# EAGLE design Peri (EAGLE 4.16)
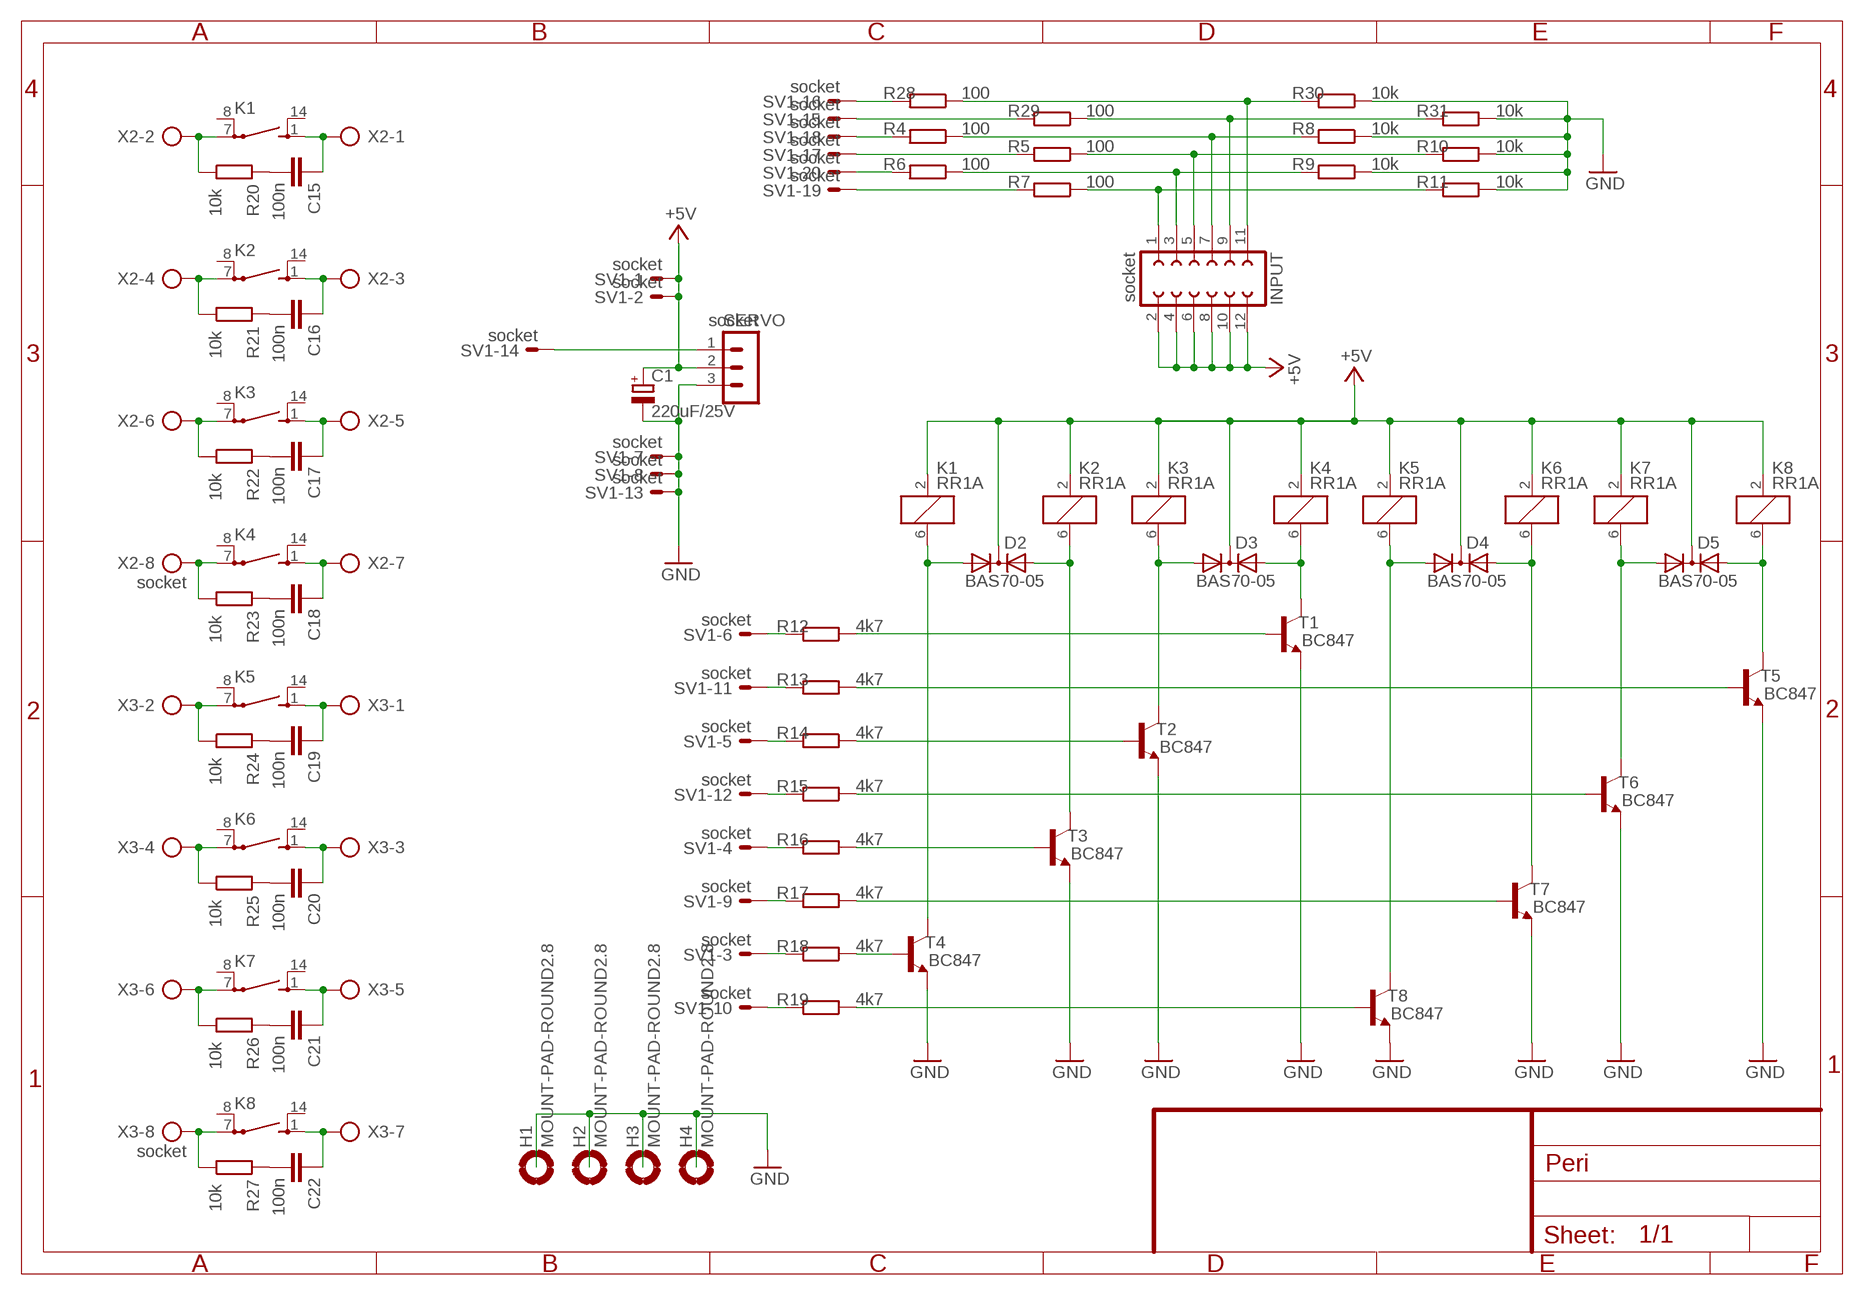
[diagram p0: schematic, sheet 1]

## Parts
C1  220uF/25V  CPOL-EUE3.5-8  [E3,5-8]
C15  100n  C-EUC0603K  [C0603K]
C16  100n  C-EUC0603K  [C0603K]
C17  100n  C-EUC0603K  [C0603K]
C18  100n  C-EUC0603K  [C0603K]
C19  100n  C-EUC0603K  [C0603K]
C20  100n  C-EUC0603K  [C0603K]
C21  100n  C-EUC0603K  [C0603K]
C22  100n  C-EUC0603K  [C0603K]
D2  BAS70-05  [SOT23]
D3  BAS70-05  [SOT23]
D4  BAS70-05  [SOT23]
D5  BAS70-05  [SOT23]
H1  MOUNT-PAD-ROUND2.8  [2,8-PAD]
H2  MOUNT-PAD-ROUND2.8  [2,8-PAD]
H3  MOUNT-PAD-ROUND2.8  [2,8-PAD]
H4  MOUNT-PAD-ROUND2.8  [2,8-PAD]
INPUT  socket  FE06-2  [FE06-2]
K1  RR1A  [RR1A]
K2  RR1A  [RR1A]
K3  RR1A  [RR1A]
K4  RR1A  [RR1A]
K5  RR1A  [RR1A]
K6  RR1A  [RR1A]
K7  RR1A  [RR1A]
K8  RR1A  [RR1A]
R4  100  R-EU_R0805  [R0805]
R5  100  R-EU_R0805  [R0805]
R6  100  R-EU_R0805  [R0805]
R7  100  R-EU_R0805  [R0805]
R8  10k  R-EU_R0805  [R0805]
R9  10k  R-EU_R0805  [R0805]
R10  10k  R-EU_R0805  [R0805]
R11  10k  R-EU_R0805  [R0805]
R12  4k7  R-EU_R0805  [R0805]
R13  4k7  R-EU_R0805  [R0805]
R14  4k7  R-EU_R0805  [R0805]
R15  4k7  R-EU_R0805  [R0805]
R16  4k7  R-EU_R0805  [R0805]
R17  4k7  R-EU_R0805  [R0805]
R18  4k7  R-EU_R0805  [R0805]
R19  4k7  R-EU_R0805  [R0805]
R20  10k  R-EU_R0805  [R0805]
R21  10k  R-EU_R0805  [R0805]
R22  10k  R-EU_R0805  [R0805]
R23  10k  R-EU_R0805  [R0805]
R24  10k  R-EU_R0805  [R0805]
R25  10k  R-EU_R0805  [R0805]
R26  10k  R-EU_R0805  [R0805]
R27  10k  R-EU_R0805  [R0805]
R28  100  R-EU_R0805  [R0805]
R29  100  R-EU_R0805  [R0805]
R30  10k  R-EU_R0805  [R0805]
R31  10k  R-EU_R0805  [R0805]
SERVO  socket  MA03-1  [MA03-1]
SV1  socket  ML20E  [ML20]
T1  BC847  [SOT23]
T2  BC847  [SOT23]
T3  BC847  [SOT23]
T4  BC847  [SOT23]
T5  BC847  [SOT23]
T6  BC847  [SOT23]
T7  BC847  [SOT23]
T8  BC847  [SOT23]
X2  socket  AK500/8  [AK500/8]
X3  socket  AK500/8  [AK500/8]

## Nets
+5V: C1.+ D2.3(C) D3.3(C) D4.3(C) D5.3(C) INPUT.2 INPUT.4 INPUT.6 INPUT.8 INPUT.10 INPUT.12 K1.2 K2.2 K3.2 K4.2 K5.2 K6.2 K7.2 K8.2 SERVO.2 SV1.1 SV1.2
GND: C1.- H1.B2,8(MOUNT) H2.B2,8(MOUNT) H3.B2,8(MOUNT) H4.B2,8(MOUNT) R8.1 R9.1 R10.1 R11.1 R30.1 R31.1 SERVO.3 SV1.7 SV1.8 SV1.13 T1.2(E) T2.2(E) T3.2(E) T4.2(E) T5.2(E) T6.2(E) T7.2(E) T8.2(E)
N$1: R14.2 SV1.5
N$2: R19.2 SV1.10
N$3: R15.2 SV1.12
N$4: R6.2 SV1.20
N$5: R7.2 SV1.19
N$6: R28.2 SV1.16
N$7: R29.2 SV1.15
N$8: R4.2 SV1.18
N$9: R5.2 SV1.17
N$10: R16.2 SV1.4
N$11: SERVO.1 SV1.14
N$12: R18.2 SV1.3
N$20: D2.1(A1) K1.6 T4.3(C)
N$21: D2.2(A2) K2.6 T3.3(C)
N$22: D3.1(A1) K3.6 T2.3(C)
N$23: D3.2(A2) K4.6 T1.3(C)
N$24: INPUT.7 R4.1 R8.2
N$25: INPUT.5 R5.1 R10.2
N$26: INPUT.3 R6.1 R9.2
N$27: INPUT.1 R7.1 R11.2
N$28: R13.1 T5.1(B)
N$29: R14.1 T2.1(B)
N$30: R15.1 T6.1(B)
N$31: R12.1 T1.1(B)
N$32: D4.1(A1) K5.6 T8.3(C)
N$33: D4.2(A2) K6.6 T7.3(C)
N$34: D5.1(A1) K7.6 T6.3(C)
N$35: D5.2(A2) K8.6 T5.3(C)
N$36: R16.1 T3.1(B)
N$37: R17.1 T7.1(B)
N$38: R18.1 T4.1(B)
N$39: R19.1 T8.1(B)
N$42: R17.2 SV1.9
N$46: R13.2 SV1.11
N$47: R12.2 SV1.6
N$48: C15.2 R20.2
N$49: C15.1 K1.1(2:S) X2.1
N$50: K1.7(2:P) R20.1 X2.2
N$51: C16.2 R21.2
N$52: C16.1 K2.1(2:S) X2.3
N$53: K2.7(2:P) R21.1 X2.4
N$54: C17.2 R22.2
N$55: C17.1 K3.1(2:S) X2.5
N$56: K3.7(2:P) R22.1 X2.6
N$57: C18.2 R23.2
N$58: C18.1 K4.1(2:S) X2.7
N$59: K4.7(2:P) R23.1 X2.8
N$60: C19.2 R24.2
N$61: C19.1 K5.1(2:S) X3.1
N$62: K5.7(2:P) R24.1 X3.2
N$63: C20.2 R25.2
N$64: C20.1 K6.1(2:S) X3.3
N$65: K6.7(2:P) R25.1 X3.4
N$66: C21.2 R26.2
N$67: C21.1 K7.1(2:S) X3.5
N$68: K7.7(2:P) R26.1 X3.6
N$69: C22.2 R27.2
N$70: C22.1 K8.1(2:S) X3.7
N$71: K8.7(2:P) R27.1 X3.8
N$74: INPUT.11 R28.1 R30.2
N$75: INPUT.9 R29.1 R31.2
Unconnected: K1.8(2:P) K1.14(2:S) K2.8(2:P) K2.14(2:S) K3.8(2:P) K3.14(2:S) K4.8(2:P) K4.14(2:S) K5.8(2:P) K5.14(2:S) K6.8(2:P) K6.14(2:S) K7.8(2:P) K7.14(2:S) K8.8(2:P) K8.14(2:S)

## Library data of the parts
C1 = rcl:CPOL-EU: POLARIZED CAPACITOR, European symbol
C15-C22 = rcl:C-EU: CAPACITOR, European symbol
D2-D5 = diode:BAS70-05: Silicon Schottky Diodes General-purpose diode for high-speed switching
H1-H4 = holes:MOUNT-PAD-ROUND: MOUNTING PAD, round
INPUT = con-lsta:FE06-2: FEMALE HEADER
K1-K8 = relay:RR1A: RELAY reed, polarity, 1 x norm. open with shield
R4-R31 = rcl:R-EU_: RESISTOR, European symbol
SERVO = con-lstb:MA03-1: PIN HEADER
SV1 = con-harting-ml:ML20?E: HARTING
T1-T8 = transistor:BC847: NPN TRANSISTOR
X2 X3 = con-ptr500:AK500/8: CONNECTOR

## Board
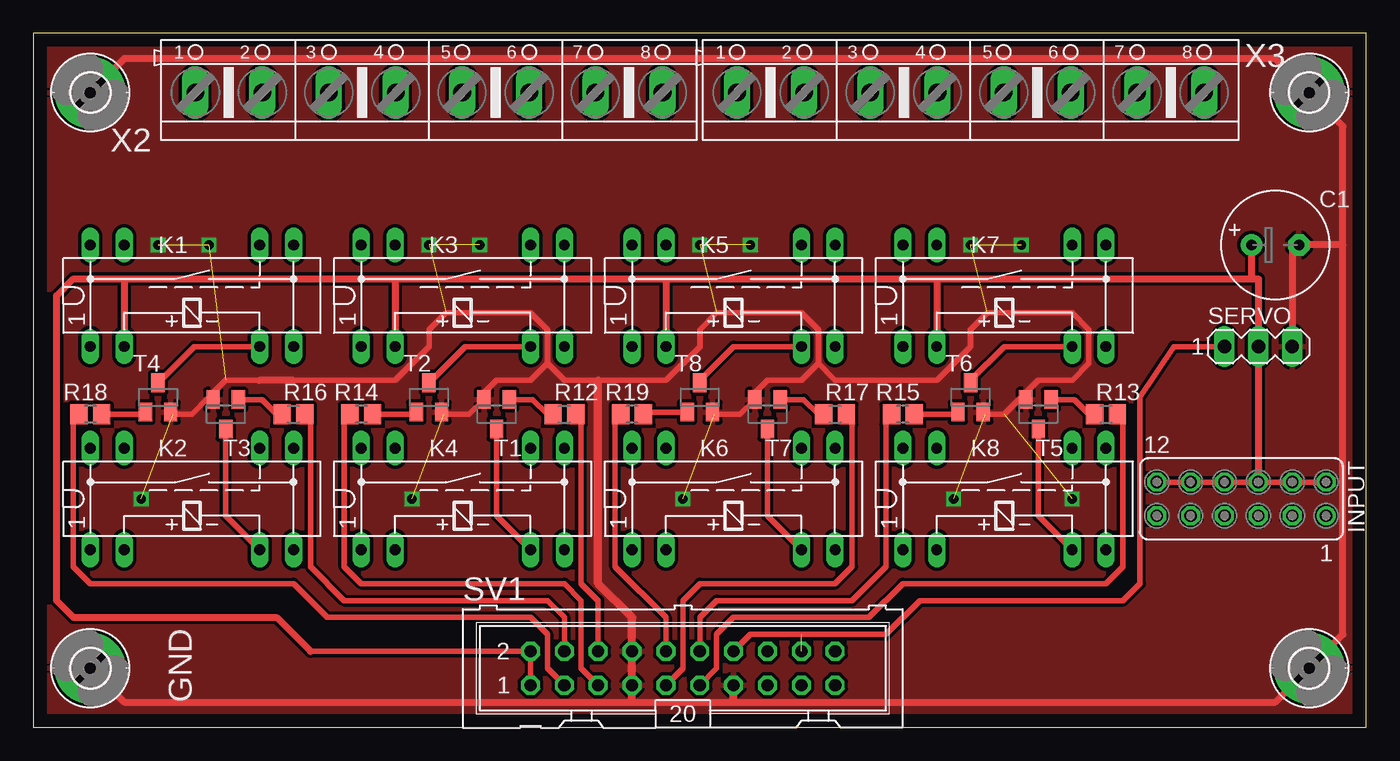
[diagram p1: board, top side]
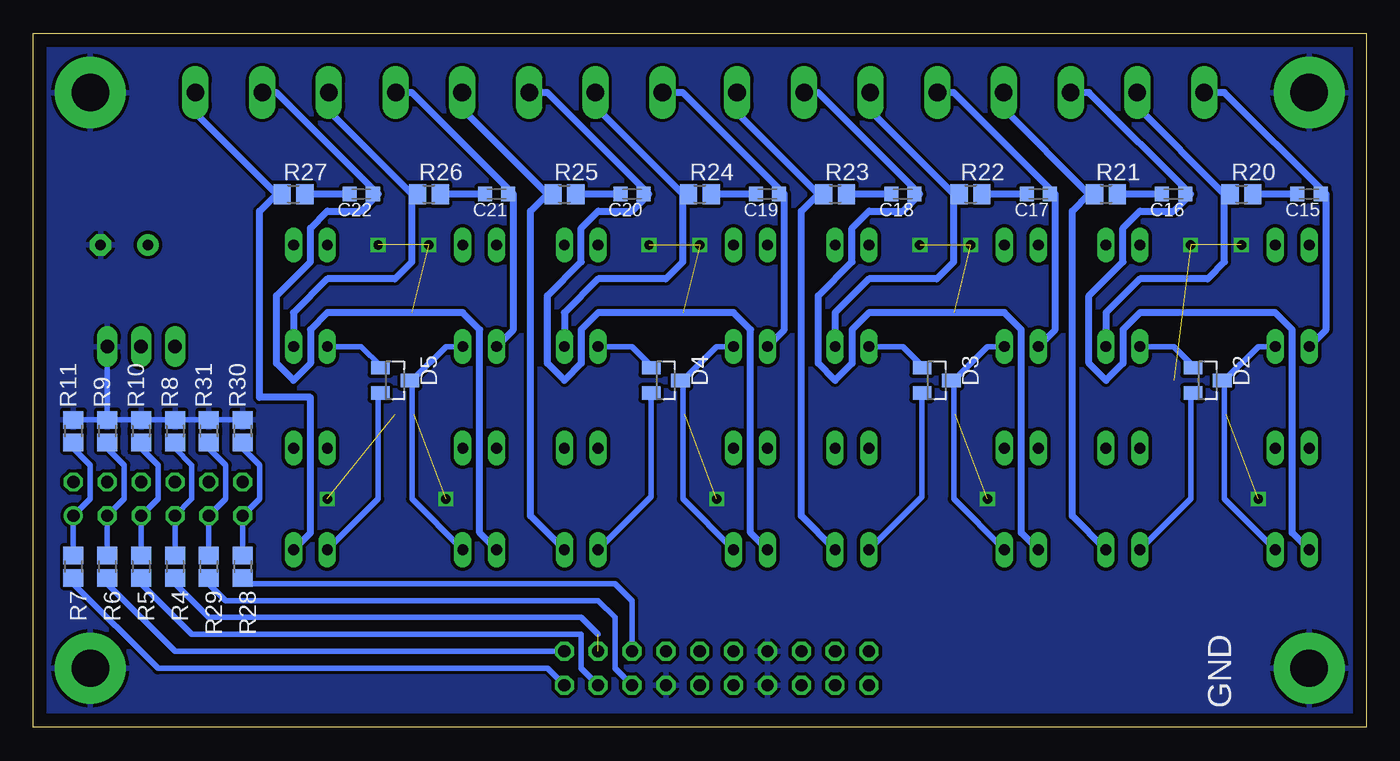
[diagram p2: board, bottom side, seen from below]

Size 100 x 52.05 mm. Coordinates in mm from the lower left corner, seen from the top.
Outline: 0,52.05 0,0 100,0 100,52.05 0,52.05
Copper layers (1*16): Top 0.035mm / dielectric 1.5mm / Bottom 0.035mm
Design rules "olimex_10mils": minimum track width 10mil, minimum drill 24mil, track to track 10mil, track to pad 10mil, pad to pad 10mil, via to via 10mil, smd to smd 10mil, copper to edge 40mil, drill to drill 10mil, minimum pad ring 10mil, minimum via ring 8mil, stop-mask expansion 0mil, vias tented up to drill 0mil, thermal gap 10mil

### Footprints (pad centres in the part's own frame; a part is rotated, then mirrored left to right if it is on the bottom)
E3,5-8 = drill 0.813 pad 1.6 round: + -1.778,0 | drill 0.813 pad 1.6 octagon: - 1.778,0
C0603K = smd 1.05 x 1.08: 1 -0.875,0; 2 0.875,0
SOT23 = smd 1 x 1.4: 1 -0.95,-1.1; 2 0.95,-1.1; 3 0,1.1
2,8-PAD = drill 2.8 pad 5.334 round: B2,8 0,0
FE06-2 = drill 0.914 round: 1 -6.35,1.27 | drill 0.914 octagon: 2 -6.35,-1.27; 3 -3.81,1.27; 4 -3.81,-1.27; 5 -1.27,1.27; 6 -1.27,-1.27; 7 1.27,1.27; 8 1.27,-1.27; 9 3.81,1.27; 10 3.81,-1.27; 11 6.35,1.27; 12 6.35,-1.27
RR1A = drill 0.813 long: 1 -7.62,-3.81; 2 -5.08,-3.81; 6 5.08,-3.81; 7 7.62,-3.81; 8 7.62,3.81; 9 5.08,3.81; 13 -5.08,3.81; 14 -7.62,3.81
R0805 = smd 1.3 x 1.5: 1 -0.85,0; 2 0.85,0
MA03-1 = drill 1.016 long: 1 -2.54,0; 2 0,0; 3 2.54,0
ML20 = drill 0.914 octagon: 1 -11.43,-1.27; 2 -11.43,1.27; 3 -8.89,-1.27; 4 -8.89,1.27; 5 -6.35,-1.27; 6 -6.35,1.27; 7 -3.81,-1.27; 8 -3.81,1.27; 9 -1.27,-1.27; 10 -1.27,1.27; 11 1.27,-1.27; 12 1.27,1.27; 13 3.81,-1.27; 14 3.81,1.27; 15 6.35,-1.27; 16 6.35,1.27; 17 8.89,-1.27; 18 8.89,1.27; 19 11.43,-1.27; 20 11.43,1.27
AK500/8 = drill 1.321 long: 1 -17.526,0; 2 -12.497,0; 3 -7.518,0; 4 -2.489,0; 5 2.489,0; 6 7.518,0; 7 12.497,0; 8 17.526,0

### Placement (x,y rotation side)
C1  93.18,36.18 0 top
C15  4.28,39.99 180 bottom
C16  14.44,39.99 180 bottom
C17  24.6,39.99 180 bottom
C18  34.76,39.99 180 bottom
C19  44.92,39.99 180 bottom
C20  55.08,39.99 180 bottom
C21  65.24,39.99 180 bottom
C22  75.4,39.99 180 bottom
D2  11.9,26.02 270 bottom
D3  32.22,26.02 270 bottom
D4  52.54,26.02 270 bottom
D5  72.86,26.02 270 bottom
H1  95.72,47.61 270 top
H2  4.28,47.61 270 top
H3  4.28,4.43 270 top
H4  95.72,4.43 270 top
INPUT  90.64,17.13 180 top
K1  11.9,32.37 0 top
K2  11.9,17.13 0 top
K3  32.22,32.37 0 top
K4  32.22,17.13 0 top
K5  52.54,32.37 0 top
K6  52.54,17.13 0 top
K7  72.86,32.37 0 top
K8  72.86,17.13 0 top
R4  89.37,12.05 270 bottom
R5  91.91,12.05 270 bottom
R6  94.45,12.05 270 bottom
R7  96.99,12.05 270 bottom
R8  89.37,22.21 270 bottom
R9  94.45,22.21 270 bottom
R10  91.91,22.21 270 bottom
R11  96.99,22.21 270 bottom
R12  39.84,23.48 0 top
R13  80.48,23.48 0 top
R14  24.6,23.48 180 top
R15  65.24,23.48 180 top
R16  19.52,23.48 0 top
R17  60.16,23.48 0 top
R18  4.28,23.48 180 top
R19  44.92,23.48 180 top
R20  9.36,39.99 0 bottom
R21  19.52,39.99 0 bottom
R22  29.68,39.99 0 bottom
R23  39.84,39.99 0 bottom
R24  50,39.99 0 bottom
R25  60.16,39.99 0 bottom
R26  70.32,39.99 0 bottom
R27  80.48,39.99 0 bottom
R28  84.29,12.05 270 bottom
R29  86.83,12.05 270 bottom
R30  84.29,22.21 270 bottom
R31  86.83,22.21 270 bottom
SERVO  91.91,28.56 0 top
SV1  48.73,4.43 0 top
T1  34.76,23.48 180 top
T2  29.68,24.75 0 top
T3  14.44,23.48 180 top
T4  9.36,24.75 0 top
T5  75.4,23.48 180 top
T6  70.32,24.75 0 top
T7  55.08,23.48 180 top
T8  50,24.75 0 top
X2  29.68,47.61 0 top
X3  70.32,47.61 0 top

### Tracks (layer width: path | path; a pad name or v marks a point on that pad's centre or on a via)
+5V
  Top 0.406: INPUT.2 INPUT.4 INPUT.6 INPUT.8 INPUT.10 INPUT.12 | 20.79,5.7 SV1.2 SV1.1
  Top 0.51: 91.4,33.64 C1.+ | 20.79,5.7 18.25,8.24 3.01,8.24 1.74,9.51 1.74,32.37 3.01,33.64 6.82,33.64 | 91.4,33.64 91.91,33.64 SERVO.2 INPUT.6 | 6.82,33.64 27.14,33.64 | 27.14,33.64 47.46,33.64 | 47.46,33.64 67.78,33.64 | 67.78,33.64 91.4,33.64 | 67.78,33.64 K7.2 | 47.46,33.64 K5.2 | 27.14,33.64 K3.2 | 6.82,33.64 K1.2
  Bottom 0.406: 51.27,26.02 D4.3 | K5.2 48.73,28.56 51.27,26.02 | 51.27,26.02 51.27,17.13 K6.2 | K3.2 28.41,28.56 30.95,26.02 | 30.95,26.02 D3.3 | K4.2 30.95,17.13 30.95,26.02 | K1.2 8.09,28.56 10.63,26.02 | 10.63,26.02 D2.3 | K2.2 10.63,17.13 10.63,26.02 | K7.2 69.05,28.56 71.59,26.02 | 71.59,26.02 D5.3 | K8.2 71.59,17.13 71.59,26.02
GND  (via drill 0.7)  (13 unrouted)
  Top 0.406: 13.17,24.75 13.34,24.58 T3.2 | 16.98,26.02 14.44,26.02 13.17,24.75 | T4.2 10.48,23.48 11.9,23.48 13.17,24.75 | T2.2 30.8,23.48 32.71,23.48 T1.2 33.66,24.58 33.49,24.75 34.76,26.02 37.3,26.02 38.57,27.29 | 19.52,26.02 27.14,26.02 29.68,28.56 29.68,29.83 30.95,31.1 37.3,31.1 38.57,29.83 38.57,27.29 | T8.2 51.12,23.48 53.03,23.48 T7.2 53.98,24.58 53.81,24.75 55.08,26.02 57.62,26.02 58.89,27.29 | 38.57,27.29 39.84,26.02 42.38,26.02 47.46,26.02 50,28.56 50,29.83 51.27,31.1 57.62,31.1 58.89,29.83 58.89,27.29 | 58.89,27.29 60.16,26.02 67.78,26.02 70.32,28.56 70.32,29.83 71.59,31.1 77.94,31.1 79.21,29.83 79.21,27.29 77.94,26.02 75.4,26.02 74.13,24.75 | 74.13,24.75 74.3,24.58 T5.2 | T6.2 71.44,23.48 72.86,23.48 74.13,24.75
  Top 0.51: 98.26,36.18 98.26,6.97 H4.B2,8 93.18,1.89 52.54,1.89 44.92,1.89 6.82,1.89 H3.B2,8 | 98.26,36.18 98.26,45.07 H1.B2,8 93.18,50.15 6.82,50.15 H2.B2,8 | 19.52,26.02 16.98,26.02 | 98.26,36.18 95.72,36.18 | 95.72,36.18 C1.- | SERVO.3 94.45,36.18 95.72,36.18
  Top 0.61: 42.38,26.02 42.38,10.78 44.92,8.24 SV1.8 SV1.7 44.92,1.89 | 52.54,1.89 SV1.13
  Bottom 0.406: R11.1 94.87,23.06 94.45,23.48 | R30.1 84.29,23.48 84.71,23.06 R31.1 86.83,23.48 87.25,23.06 R8.1 89.37,23.48 89.79,23.06 R10.1 91.91,23.48 92.33,23.06 R9.1 94.45,23.48 | SERVO.3 94.45,23.48
  other vias: 74.13,36.18 70.32,36.18 53.81,36.18 50,36.18 33.49,36.18 29.68,36.18 13.17,36.18 9.36,36.18 77.94,17.13 69.05,17.13 48.73,17.13 28.41,17.13 8.09,17.13
  pour Top (isolate 0.254): 0.47,51.42 99.53,51.42 99.53,0.62 0.47,0.62
  pour Bottom (isolate 0.254): 0.47,51.42 99.53,51.42 99.53,0.62 0.47,0.62 0.47,50.15
N$1
  Top 0.406: R14.2 23.33,23.48 23.33,12.05 24.6,10.78 39.84,10.78 41.11,9.51 41.11,4.43 SV1.5
N$2
  Top 0.406: R19.2 43.65,23.48 43.65,12.05 47.46,8.24 SV1.10
N$3
  Top 0.406: R15.2 63.97,23.48 63.97,12.05 61.43,9.51 51.27,9.51 50,8.24 SV1.12
N$4
  Bottom 0.406: R6.2 94.45,10.78 89.37,5.7 SV1.20
N$5
  Bottom 0.406: R7.2 96.99,10.78 90.64,4.43 61.43,4.43 SV1.19
N$6
  Bottom 0.406: R28.2 84.29,10.78 56.35,10.78 55.08,9.51 SV1.16
N$7
  Bottom 0.406: R29.2 86.83,10.78 85.56,9.51 57.62,9.51 56.35,8.24 56.35,4.43 SV1.15
N$8  (1 unrouted)
  Bottom 0.406: R4.2 89.37,10.78 86.83,8.24 58.89,8.24 57.62,6.97
N$9
  Bottom 0.406: R5.2 91.91,10.78 88.1,6.97 58.89,6.97 58.89,4.43 SV1.17
N$10
  Top 0.406: R16.2 20.79,23.48 20.79,12.05 23.33,9.51 38.57,9.51 39.84,8.24 SV1.4
N$11
  Top 0.406: SERVO.1 85.56,28.56 83.02,24.75 83.02,10.78 81.75,9.51 66.51,9.51 63.97,6.97 53.81,6.97 SV1.14
N$12
  Top 0.406: R18.2 3.01,23.48 3.01,12.05 4.28,10.78 19.52,10.78 22.06,8.24 37.3,8.24 38.57,6.97 38.57,4.43 SV1.3
N$20
  Top 0.406: T4.3 12.07,28.56 K1.6
  Bottom 0.406: D2.1 13,27.12 14.44,28.56 K1.6
N$21
  Top 0.406: T3.3 14.44,15.86 K2.6
  Bottom 0.406: D2.2 13.17,24.9 13.17,17.13 K2.6
N$22
  Top 0.406: T2.3 32.39,28.56 K3.6
  Bottom 0.406: D3.1 33.32,27.12 34.76,28.56 K3.6
N$23
  Top 0.406: T1.3 34.76,15.86 K4.6
  Bottom 0.406: D3.2 33.32,17.3 K4.6
N$24
  Bottom 0.406: R4.1 INPUT.7 88.1,17.13 88.1,19.67 89.37,20.94 R8.2
N$25
  Bottom 0.406: R5.1 INPUT.5 90.64,17.13 90.64,19.67 91.91,20.94 R10.2
N$26
  Bottom 0.406: R6.1 INPUT.3 93.18,17.13 93.18,19.67 94.45,20.94 R9.2
N$27
  Bottom 0.406: R7.1 INPUT.1 95.72,17.13 95.72,19.67 96.99,20.94 R11.2
N$28
  Top 0.406: R13.1 79.21,23.48 78.11,24.58 T5.1
N$29
  Top 0.406: T2.1 28.56,23.48 R14.1
N$30
  Top 0.406: T6.1 69.2,23.48 R15.1
N$31
  Top 0.406: R12.1 38.57,23.48 37.47,24.58 T1.1
N$32
  Top 0.406: T8.3 50,26.02 52.54,28.56 K5.6
  Bottom 0.406: D4.1 53.64,27.12 55.08,28.56 K5.6
N$33
  Top 0.406: K6.6 55.08,15.86 T7.3
  Bottom 0.406: D4.2 53.64,17.3 K6.6
N$34
  Top 0.406: T6.3 70.32,26.02 72.86,28.56 K7.6
  Bottom 0.406: D5.1 73.96,27.12 75.4,28.56 K7.6
N$35
  Top 0.406: K8.6 75.4,15.86 T5.3
  Bottom 0.406: D5.2 74.13,24.9 74.13,17.13 K8.6
N$36
  Top 0.406: R16.1 18.25,23.48 17.15,24.58 T3.1
N$37
  Top 0.406: R17.1 58.89,23.48 57.79,24.58 T7.1
N$38
  Top 0.406: T4.1 8.24,23.48 R18.1
N$39
  Top 0.406: R19.1 46.19,23.48 46.36,23.65 T8.1
N$42
  Top 0.406: R17.2 61.43,23.48 61.43,12.05 60.16,10.78 50,10.78 48.73,9.51 48.73,4.43 SV1.9
N$46
  Top 0.406: R13.2 81.75,23.06 81.75,12.05 80.48,10.78 65.24,10.78 62.7,8.24 52.54,8.24 51.27,6.97 51.27,4.43 SV1.11
N$47
  Top 0.406: 41.11,23.48 41.11,10.78 42.38,9.51 SV1.6
  Top 0.51: 41.11,23.48 R12.2
N$48
  Bottom 0.51: C15.2 R20.2
N$49
  Bottom 0.51: X2.1 10.63,47.61 3.01,39.99 | 3.01,39.99 C15.1 | K1.1 3.01,29.83 3.01,39.99
N$50
  Bottom 0.51: K1.7 19.52,31.1 16.98,33.64 11.9,33.64 10.63,34.91 10.63,39.99 | 10.63,39.99 R20.1 | X2.2 17.18,46.54 10.63,39.99
N$51
  Bottom 0.51: C16.2 R21.2
N$52
  Bottom 0.51: K2.1 5.55,14.59 5.55,29.83 6.82,31.1 16.98,31.1 18.25,29.83 18.25,27.29 19.52,26.02 20.79,27.29 20.79,32.37 18.25,34.91 18.25,37.45 16.98,38.72 14.44,38.72 13.17,39.99 | 13.17,39.99 C16.1 | X2.3 20.79,47.61 13.17,39.99
N$53
  Bottom 0.51: K2.7 22.06,15.86 22.06,38.72 20.79,39.99 | 20.79,39.99 R21.1 | X2.4 27.19,46.39 20.79,39.99
N$54
  Bottom 0.51: C17.2 R22.2
N$55
  Bottom 0.51: K3.1 23.33,29.83 23.33,39.99 | 23.33,39.99 C17.1 | X2.5 30.95,47.61 23.33,39.99
N$56
  Bottom 0.51: K3.7 39.84,31.1 37.3,33.64 32.22,33.64 30.95,34.91 30.95,39.99 | 30.95,39.99 R22.1 | X2.6 37.2,46.24 30.95,39.99
N$57
  Bottom 0.51: C18.2 R23.2
N$58
  Bottom 0.51: K4.1 25.87,14.59 25.87,29.83 27.14,31.1 37.3,31.1 38.57,29.83 38.57,27.29 39.84,26.02 41.11,27.29 41.11,32.37 38.57,34.91 38.57,37.45 37.3,38.72 34.76,38.72 33.49,39.99 | 33.49,39.99 C18.1 | X2.7 41.11,47.61 33.49,39.99
N$59
  Bottom 0.51: K4.7 42.38,15.86 42.38,38.72 41.11,39.99 | 41.11,39.99 R23.1 | X2.8 47.21,46.09 41.11,39.99
N$60
  Bottom 0.51: C19.2 R24.2
N$61
  Bottom 0.51: K5.1 43.65,29.83 43.65,39.99 | 43.65,39.99 C19.1 | X3.1 51.27,47.61 43.65,39.99
N$62
  Bottom 0.51: K5.7 60.16,31.1 57.62,33.64 52.54,33.64 51.27,34.91 51.27,39.99 | 51.27,39.99 R24.1 | X3.2 57.82,46.54 51.27,39.99
N$63
  Bottom 0.51: C20.2 R25.2
N$64
  Bottom 0.51: K6.1 46.19,14.59 46.19,29.83 47.46,31.1 57.62,31.1 58.89,29.83 58.89,27.29 60.16,26.02 61.43,27.29 61.43,32.37 58.89,34.91 58.89,37.45 57.62,38.72 55.08,38.72 53.81,39.99 | 53.81,39.99 C20.1 | X3.3 61.43,47.61 53.81,39.99
N$65
  Bottom 0.51: K6.7 62.7,15.86 62.7,38.72 61.43,39.99 | 61.43,39.99 R25.1 | X3.4 67.83,46.39 61.43,39.99
N$66
  Bottom 0.51: C21.2 R26.2
N$67
  Top 0.406: X3.5 72.86,47.61
  Bottom 0.51: 72.86,47.61 X3.5 71.59,47.61 63.97,39.99 | K7.1 63.97,29.83 63.97,39.99 | 63.97,39.99 C21.1
N$68
  Top 0.406: X3.6 77.94,47.61
  Bottom 0.51: X3.6 77.94,47.61 77.94,46.34 71.59,39.99 | K7.7 80.48,31.1 77.94,33.64 72.86,33.64 71.59,34.91 71.59,39.99 | 71.59,39.99 R26.1
N$69
  Bottom 0.51: C22.2 R27.2
N$70
  Bottom 0.51: 83.02,47.61 X3.7 81.75,47.61 74.13,39.99 | K8.1 66.51,14.59 66.51,29.83 67.78,31.1 77.94,31.1 79.21,29.83 79.21,27.29 80.48,26.02 81.75,27.29 81.75,32.37 79.21,34.91 79.21,37.45 77.94,38.72 75.4,38.72 74.13,39.99 | 74.13,39.99 C22.1
N$71
  Bottom 0.51: X3.8 88.1,47.61 88.1,46.34 81.75,39.99 | 81.75,39.99 R27.1 | 81.75,39.99 83.02,38.72 83.02,24.75 79.21,24.75 79.21,14.59 K8.7
N$74
  Bottom 0.406: R28.1 INPUT.11 83.02,17.13 83.02,19.67 84.29,20.94 R30.2
N$75
  Bottom 0.406: R29.1 INPUT.9 85.56,17.13 85.56,19.67 86.83,20.94 R31.2

### Text on the board
tNames: GND
bNames: GND